# EAGLE design reversed (EAGLE 9.6.2)
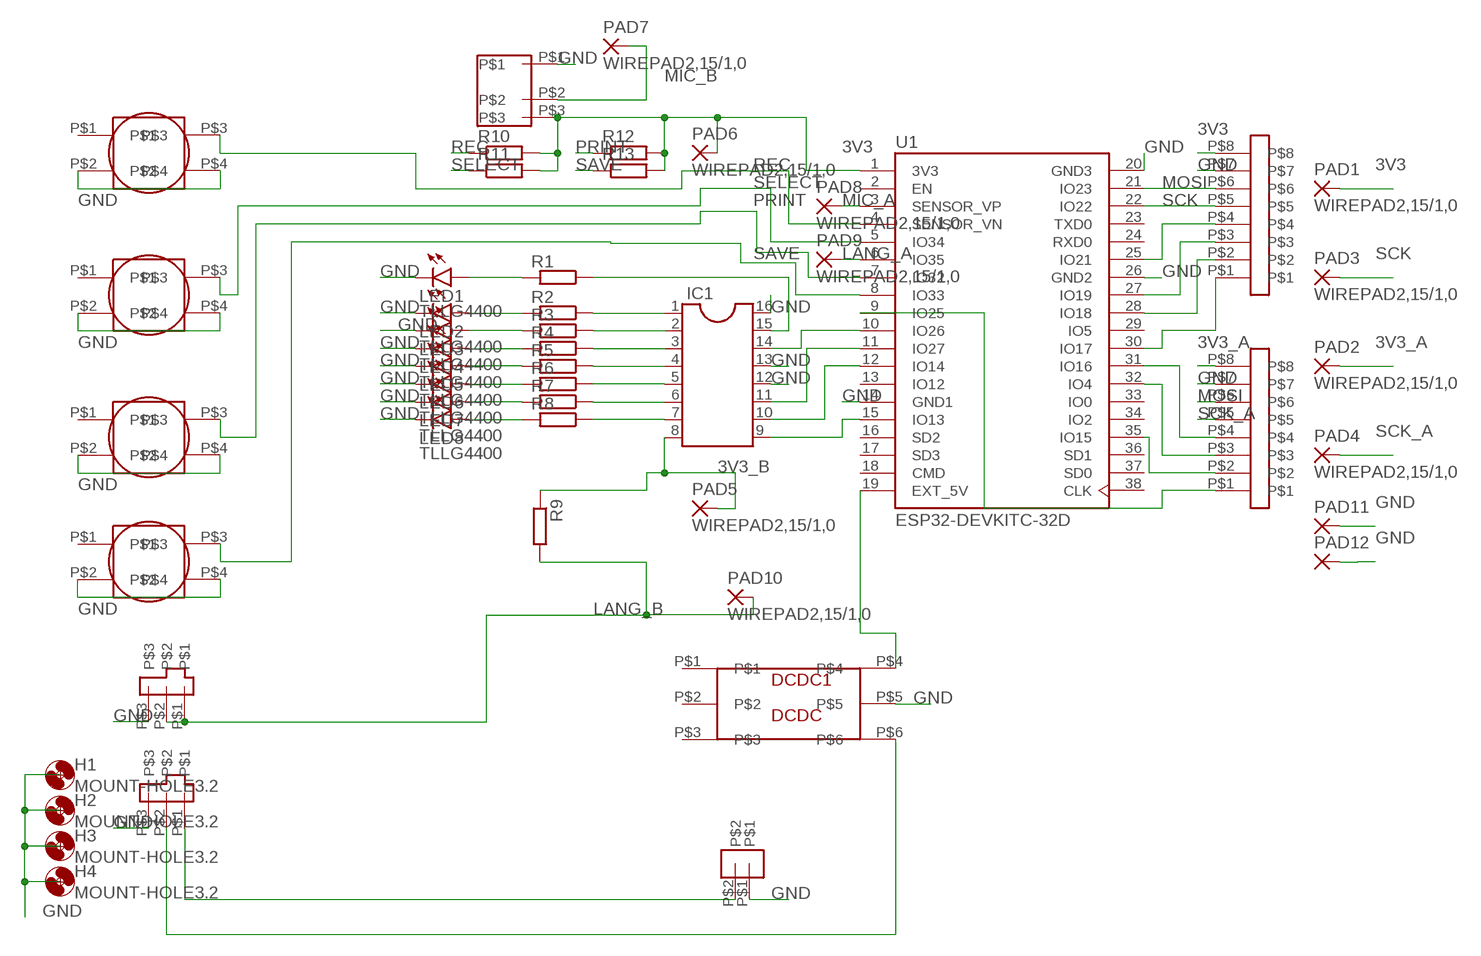
[diagram p0: schematic, sheet 1]

## Parts
BATTERY1  BATTERY  [BATTERY]
DCDC1  DCDC  [DCDC]
DISPLAY1  DISPLAY  [DISPLAY]
DISPLAY2  DISPLAY  [DISPLAY]
H1  MOUNT-HOLE3.2  [3,2]
H2  MOUNT-HOLE3.2  [3,2]
H3  MOUNT-HOLE3.2  [3,2]
H4  MOUNT-HOLE3.2  [3,2]
IC1  DIL16S  [SOCKET-16]
LED1  TLLG4400  [LED3MM]
LED2  TLLG4400  [LED3MM]
LED3  TLLG4400  [LED3MM]
LED4  TLLG4400  [LED3MM]
LED5  TLLG4400  [LED3MM]
LED6  TLLG4400  [LED3MM]
LED7  TLLG4400  [LED3MM]
LED8  TLLG4400  [LED3MM]
MIC1  MIC  [MIC]
PAD1  WIREPAD2,15/1,0  [2,15/1,0]
PAD2  WIREPAD2,15/1,0  [2,15/1,0]
PAD3  WIREPAD2,15/1,0  [2,15/1,0]
PAD4  WIREPAD2,15/1,0  [2,15/1,0]
PAD5  WIREPAD2,15/1,0  [2,15/1,0]
PAD6  WIREPAD2,15/1,0  [2,15/1,0]
PAD7  WIREPAD2,15/1,0  [2,15/1,0]
PAD8  WIREPAD2,15/1,0  [2,15/1,0]
PAD9  WIREPAD2,15/1,0  [2,15/1,0]
PAD10  WIREPAD2,15/1,0  [2,15/1,0]
PAD11  2,15/1,0  [2,15/1,0]
PAD12  2,15/1,0  [2,15/1,0]
R1  SMK  [SMK]
R2  SMK  [SMK]
R3  SMK  [SMK]
R4  SMK  [SMK]
R5  SMK  [SMK]
R6  SMK  [SMK]
R7  SMK  [SMK]
R8  SMK  [SMK]
R9  R-EU_0207/10  [0207/10]
R10  R-EU_0207/10  [0207/10]
R11  R-EU_0207/10  [0207/10]
R12  R-EU_0207/10  [0207/10]
R13  R-EU_0207/10  [0207/10]
SWITCH1  SWITCH  [SWITCH]
SWITCH2  SWITCH  [SWITCH]
SWITCH3  SWITCH  [SWITCH]
SWITCH4  SWITCH  [SWITCH]
TOGGLE1  TOGGLE  [TOGGLE]
TOGGLE2  TOGGLE  [TOGGLE]
U1  ESP32-DEVKITC-32D  [MODULE_ESP32-DEVKITC-32D]

## Nets
3V3: DISPLAY1.P$8 MIC1.P$3 PAD1.1(P) PAD6.1(P) R10.2 R11.2 R12.2 R13.2 U1.1(3V3)
3V3_A: DISPLAY2.P$8 PAD2.1(P)
3V3_B: IC1.8 PAD5.1(P) R9.1
GND: BATTERY1.P$1 DCDC1.P$5 DISPLAY1.P$7 DISPLAY2.P$7 IC1.12 IC1.13 IC1.16 LED1.K(C) LED2.K(C) LED3.K(C) LED4.K(C) LED5.K(C) LED6.K(C) LED7.K(C) LED8.K(C) MIC1.P$1 PAD11.1(P) PAD12.1(P) SWITCH1.P$2 SWITCH1.P$4 SWITCH2.P$2 SWITCH2.P$4 SWITCH3.P$2 SWITCH3.P$4 SWITCH4.P$2 SWITCH4.P$4 TOGGLE1.P$3 TOGGLE2.P$3 U1.14(GND1) U1.20(GND3) U1.26(GND2)
LANG_A: PAD9.1(P) U1.6(IO35)
LANG_B: PAD10.1(P) R9.2 TOGGLE1.P$1 TOGGLE1.P$2
MIC_A: PAD8.1(P) U1.3(SENSOR_VP)
MIC_B: MIC1.P$2 PAD7.1(P)
MOSI: DISPLAY1.P$6 DISPLAY2.P$6 U1.21(IO23)
N$1: DISPLAY1.P$4 U1.25(IO21)
N$2: DISPLAY1.P$3 U1.27(IO19)
N$3: DISPLAY1.P$2 U1.28(IO18)
N$4: DISPLAY1.P$1 U1.30(IO17)
N$5: DISPLAY2.P$4 U1.31(IO16)
N$6: DISPLAY2.P$3 U1.32(IO4)
N$7: DISPLAY2.P$2 U1.35(IO15)
N$8: DISPLAY2.P$1 U1.9(IO25)
N$9: IC1.9 U1.15(IO13)
N$10: IC1.10 U1.12(IO14)
N$11: IC1.11 U1.11(IO27)
N$12: IC1.14 U1.10(IO26)
N$13: IC1.15 R1.1
N$14: IC1.1 R2.1
N$15: IC1.2 R3.1
N$16: IC1.3 R4.1
N$17: IC1.4 R5.1
N$18: IC1.5 R6.1
N$19: IC1.6 R7.1
N$20: IC1.7 R8.1
N$21: DCDC1.P$4 U1.19(EXT_5V)
N$22: LED1.A R1.2
N$23: LED2.A R2.2
N$24: LED3.A R3.2
N$25: LED4.A R4.2
N$26: LED5.A R5.2
N$27: LED6.A R6.2
N$28: LED7.A R7.2
N$29: LED8.A R8.2
N$30: DCDC1.P$6 TOGGLE2.P$2
N$31: BATTERY1.P$2 TOGGLE2.P$1
PRINT: R12.1 SWITCH3.P$3 U1.7(IO32)
REC: R10.1 SWITCH1.P$3 U1.4(SENSOR_VN)
SAVE: R13.1 SWITCH4.P$3 U1.8(IO33)
SCK: DISPLAY1.P$5 PAD3.1(P) U1.22(IO22)
SCK_A: DISPLAY2.P$5 PAD4.1(P)
SELECT: R11.1 SWITCH2.P$3 U1.5(IO34)
Unconnected: DCDC1.P$1 DCDC1.P$2 DCDC1.P$3 SWITCH1.P$1 SWITCH2.P$1 SWITCH3.P$1 SWITCH4.P$1 U1.2(EN) U1.13(IO12) U1.16(SD2) U1.17(SD3) U1.18(CMD) U1.23(TXD0) U1.24(RXD0) U1.29(IO5) U1.33(IO0) U1.34(IO2) U1.36(SD1) U1.37(SD0) U1.38(CLK)

## Library data of the parts
BATTERY1 = BATTERY:BATTERY
DCDC1 = DCDC:DCDC
DISPLAY1 DISPLAY2 = DISPLAY:DISPLAY
H1-H4 = holes:MOUNT-HOLE: MOUNTING HOLE with drill center marker
IC1 = ic-package:DIL16: Dual In Line / Socket
LED1-LED8 = led:TLLG4400: Low Current (2mA) LED 3 mm Tinted Diffused Package color GREEN Source: Data sheet <http://www.farnell.com/datasheets/391098.pdf>; MF: VISHAY SEMICONDUCTOR; OC_FARNELL: 1612435
MIC1 = MIC:MIC
PAD1-PAD10 = wirepad:WIREPAD: Wire PAD connect wire on PCB
PAD11 PAD12 = wirepad:2,15/1,0: THROUGH-HOLE PAD
R1-R8 = resistor-shunt:SMK: SMD SHUNT RESISTOR; OC_FARNELL: unknown; OC_NEWARK: unknown
R9-R13 = rcl:R-EU_: RESISTOR, European symbol; SPICEPREFIX: R
SWITCH1-SWITCH4 = SWITCH:SWITCH
TOGGLE1 TOGGLE2 = TOGGLE:TOGGLE
U1 = ESP32-DEVKITC-32D:ESP32-DEVKITC-32D: Eval Board For Esp-Wroom-32 Check availability <https://pricing.snapeda.com/parts/ESP32-DEVKITC-32D/Espressif%20Systems/view-part?ref=eda>; AVAILABILITY: In Stock; DESCRIPTION: WiFi Development Tools (802.11) ESP32 General Development Kit, ESP32-WROOM-32D on the board; MF: Espressif Systems; MP: ESP32-DEVKITC-32D; PACKAGE: None; PRICE: None; PURCHASE-URL: https://pricing.snapeda.com/search/part/ESP32-DEVKITC-32D/?ref=eda

## Board
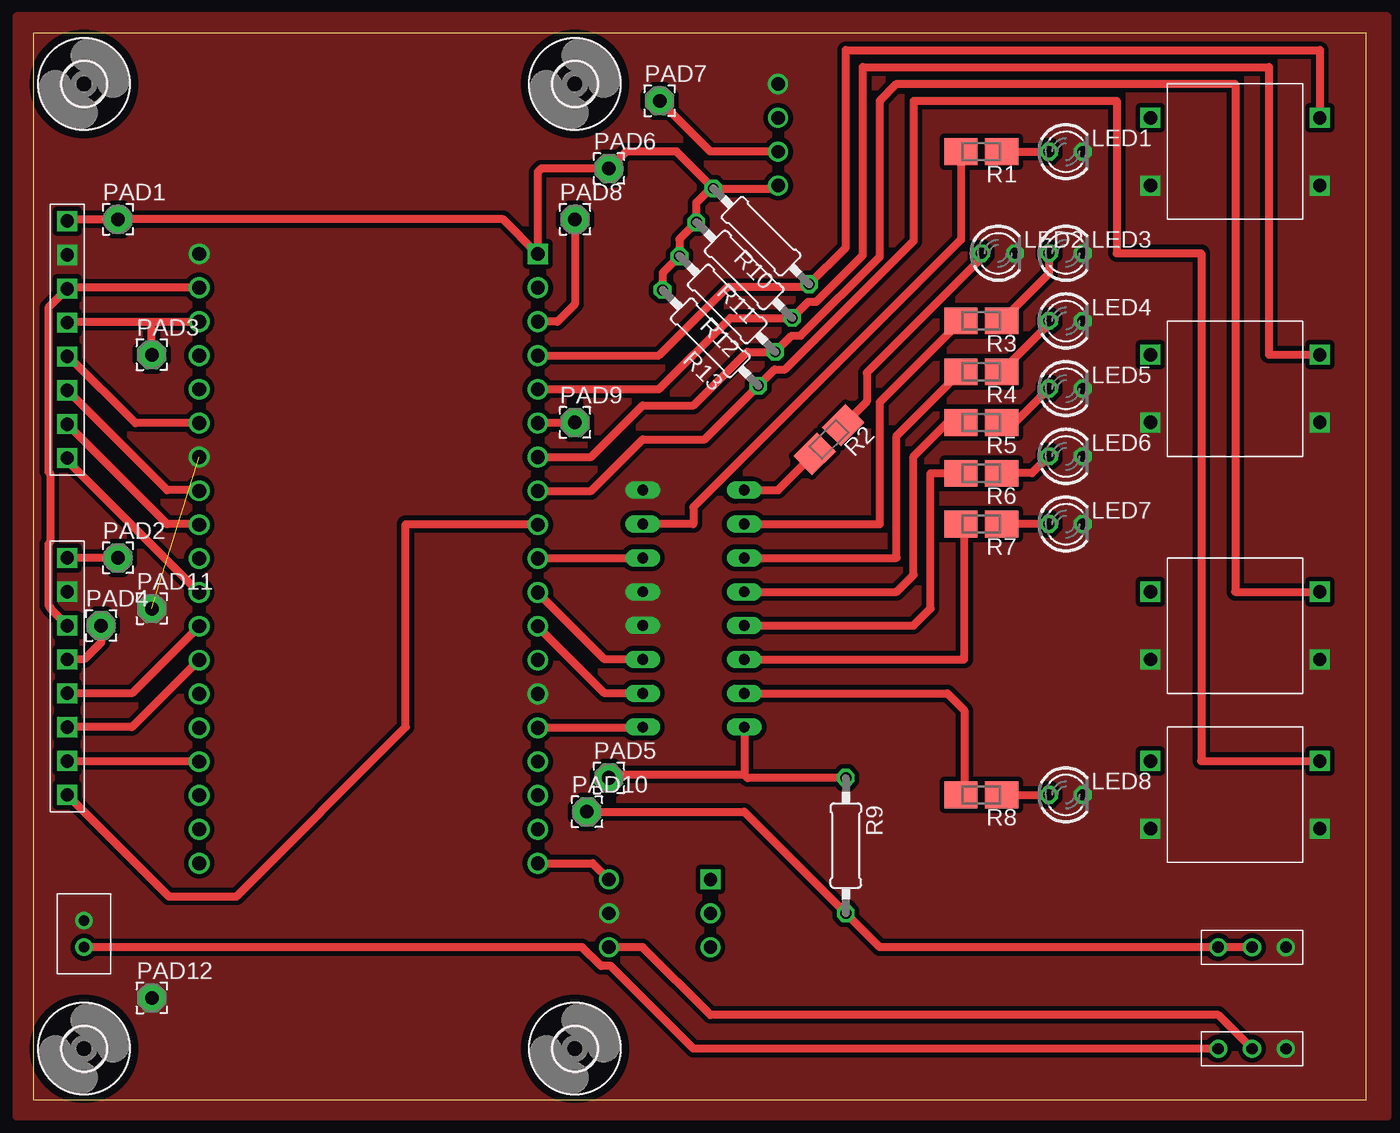
[diagram p1: board, top side]
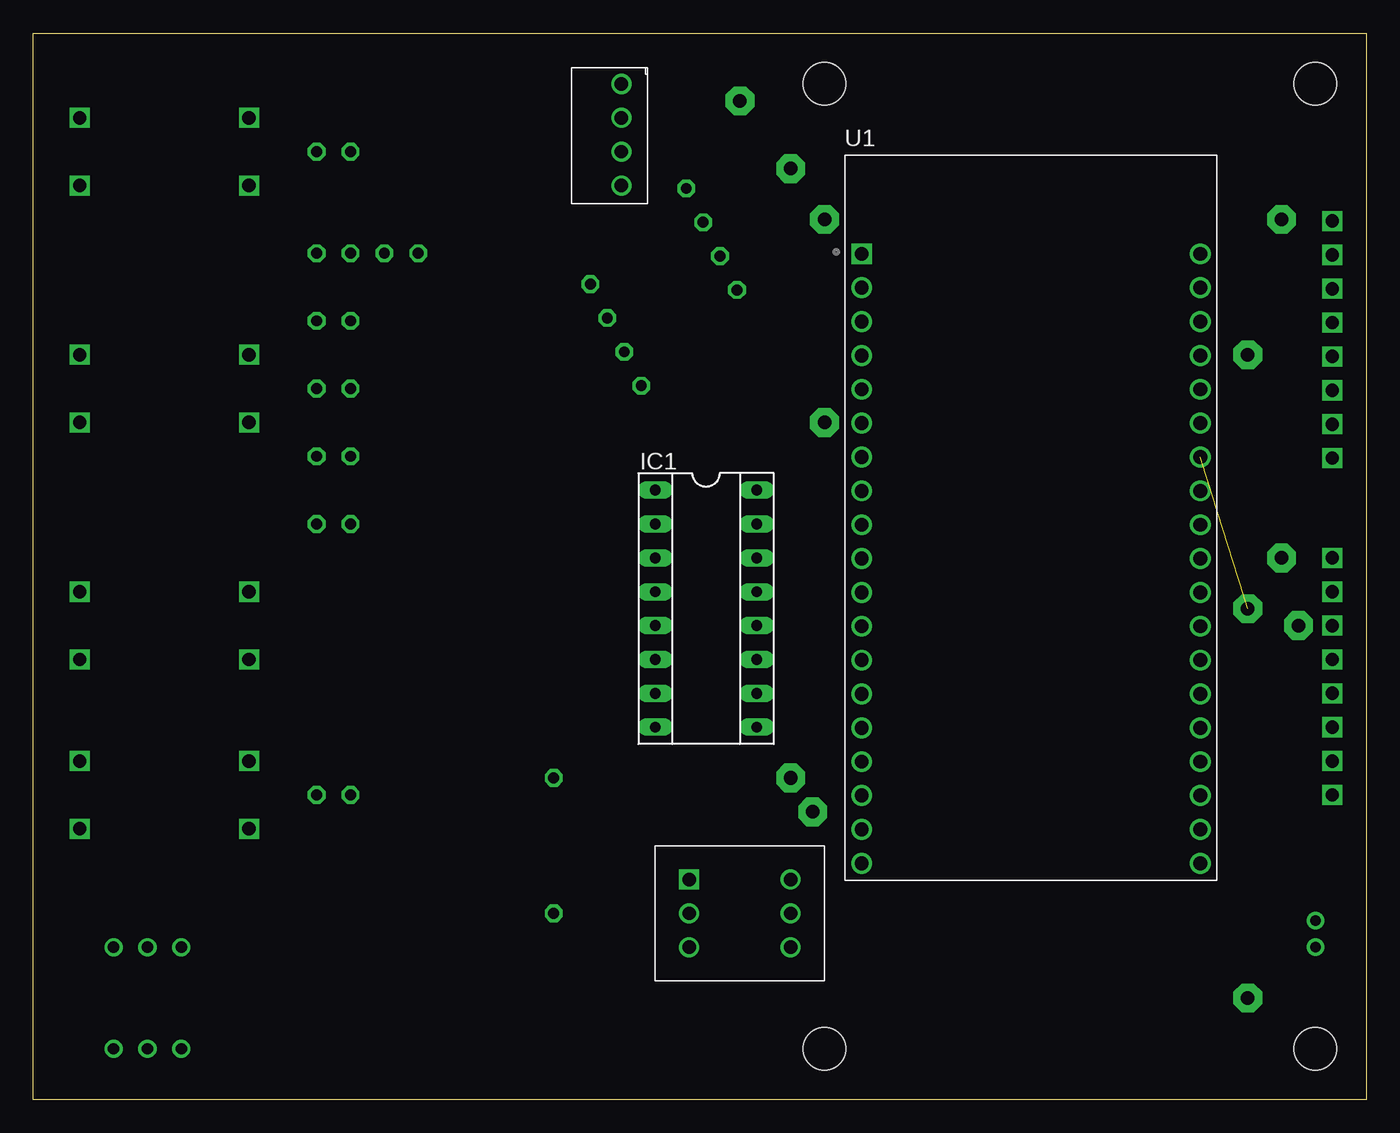
[diagram p2: board, bottom side, seen from below]

Size 100 x 80 mm. Coordinates in mm from the lower left corner, seen from the top.
Outline: 0,0 100,0 100,80 0,80 0,0
Copper layers (1*16): Top 0.035mm / dielectric 1.5mm / Bottom 0.035mm
Design rules "default *": minimum track width 6mil, minimum drill 0.6mm, track to track 14mil, track to pad 14mil, pad to pad 14mil, via to via 14mil, smd to smd 6mil, copper to edge 0mil, drill to drill 6mil, minimum pad ring 10mil, minimum via ring 8mil, stop-mask expansion 4mil, vias tented up to drill 0mil, thermal gap 10mil

### Footprints (pad centres in the part's own frame; a part is rotated, then mirrored left to right if it is on the bottom)
BATTERY = drill 0.8: P$1 0,2; P$2 0,0
DCDC = drill 1 square: P$1 -5.08,2.54 | drill 1: P$2 -5.08,0; P$3 -5.08,-2.54; P$4 2.54,2.54; P$5 2.54,0; P$6 2.54,-2.54
DISPLAY = drill 1 square: P$1 0,7.62; P$2 0,5.08; P$3 0,2.54; P$4 0,0; P$5 0,-2.54; P$6 0,-5.08; P$7 0,-7.62; P$8 0,-10.16
3,2 = hole 3.2: 0,0
SOCKET-16 = drill 0.813 long: 1 -8.89,-3.81; 2 -6.35,-3.81; 3 -3.81,-3.81; 4 -1.27,-3.81; 5 1.27,-3.81; 6 3.81,-3.81; 7 6.35,-3.81; 8 8.89,-3.81; 9 8.89,3.81; 10 6.35,3.81; 11 3.81,3.81; 12 1.27,3.81; 13 -1.27,3.81; 14 -3.81,3.81; 15 -6.35,3.81; 16 -8.89,3.81
LED3MM = drill 0.813 octagon: A -1.27,0; K 1.27,0
MIC = drill 1: P$1 2.54,5.08; P$2 2.54,0; P$3 2.54,-2.54; P$4 2.54,2.54
2,15/1,0 = drill 1.016 pad 2.159 octagon: 1 0,0
SMK = smd 2.5 x 2: 1 1.524,0; 2 -1.524,0
0207/10 = drill 0.813 octagon: 1 -5.08,0; 2 5.08,0
SWITCH = drill 1 square: P$1 -6.35,2.54; P$2 -6.35,-2.54; P$3 6.35,2.54; P$4 6.35,-2.54
TOGGLE = drill 0.85: P$1 0,2.54; P$2 0,0; P$3 0,-2.54
MODULE_ESP32-DEVKITC-32D = drill 1.04 square: 1 -12.7,19.76 | drill 1.04: 2 -12.7,17.22; 3 -12.7,14.68; 4 -12.7,12.14; 5 -12.7,9.6; 6 -12.7,7.06; 7 -12.7,4.52; 8 -12.7,1.98; 9 -12.7,-0.56; 10 -12.7,-3.1; 11 -12.7,-5.64; 12 -12.7,-8.18; 13 -12.7,-10.72; 14 -12.7,-13.26; 15 -12.7,-15.8; 16 -12.7,-18.34; 17 -12.7,-20.88; 18 -12.7,-23.42; 19 -12.7,-25.96; 20 12.7,19.76; 21 12.7,17.22; 22 12.7,14.68; 23 12.7,12.14; 24 12.7,9.6; 25 12.7,7.06; 26 12.7,4.52; 27 12.7,1.98; 28 12.7,-0.56; 29 12.7,-3.1; 30 12.7,-5.64; 31 12.7,-8.18; 32 12.7,-10.72; 33 12.7,-13.26; 34 12.7,-15.8; 35 12.7,-18.34; 36 12.7,-20.88; 37 12.7,-23.42; 38 12.7,-25.96

### Placement (x,y rotation side)
BATTERY1  3.81,11.43 0 top
DCDC1  45.72,13.97 0 bottom
DISPLAY1  2.54,55.75 180 top
DISPLAY2  2.54,30.48 180 top
H1  3.81,3.81 0 top
H2  40.64,3.81 0 top
H3  40.64,76.2 0 top
H4  3.81,76.2 0 top
IC1  49.53,36.83 270 bottom
LED1  77.47,71.12 0 top
LED2  72.39,63.5 0 top
LED3  77.47,63.5 0 top
LED4  77.47,58.42 0 top
LED5  77.47,53.34 0 top
LED6  77.47,48.26 0 top
LED7  77.47,43.18 0 top
LED8  77.47,22.86 0 top
MIC1  58.42,71.12 0 bottom
PAD1  6.35,66.04 0 top
PAD2  6.35,40.64 0 top
PAD3  8.89,55.88 0 top
PAD4  5.08,35.56 0 top
PAD5  43.18,24.13 0 top
PAD6  43.18,69.85 0 top
PAD7  46.99,74.93 0 top
PAD8  40.64,66.04 0 top
PAD9  40.64,50.8 0 top
PAD10  41.53,21.59 0 top
PAD11  8.89,36.83 0 top
PAD12  8.89,7.62 0 top
R1  71.12,71.12 180 top
R2  59.69,49.53 225 top
R3  71.12,58.42 180 top
R4  71.12,54.61 180 top
R5  71.12,50.8 180 top
R6  71.12,46.99 180 top
R7  71.12,43.18 180 top
R8  71.12,22.86 180 top
R9  60.96,19.05 270 top
R10  54.61,64.77 135 top
R11  53.34,62.23 135 top
R12  52.07,59.69 135 top
R13  50.8,57.15 135 top
SWITCH1  90.17,71.12 0 top
SWITCH2  90.17,53.34 0 top
SWITCH3  90.17,35.56 0 top
SWITCH4  90.17,22.86 0 top
TOGGLE1  91.44,11.43 90 top
TOGGLE2  91.44,3.81 90 top
U1  25.15,43.69 0 bottom

### Tracks (layer width: path | path; a pad name or v marks a point on that pad's centre or on a via)
3V3
  Top 0.61: DISPLAY1.P$8 2.67,66.04 PAD1.1 35.25,66.04 U1.1 37.85,69.6 38.1,69.85 PAD6.1 44.45,71.12 48.26,71.12 R10.2 | R10.2 51.02,68.58 49.75,67.31 R11.2 48.48,64.55 R12.2 47.21,62.01 R13.2 | R10.2 55.66,68.36 MIC1.P$3
3V3_A
  Top 0.61: PAD2.1 DISPLAY2.P$8
3V3_B
  Top 0.61: PAD5.1 43.43,24.38 53.34,24.38 | IC1.8 53.34,24.38 | R9.1 53.59,24.13 53.34,24.38
GND  (1 unrouted)
  pour Top (no thermals): 101.6,81.28 -1.27,81.28 -1.27,-1.27 101.6,-1.27
LANG_A
  Top 0.61: U1.6 37.9,50.8 PAD9.1
LANG_B
  Top 0.61: TOGGLE1.P$2 TOGGLE1.P$1 63.5,11.43 R9.2 53.34,21.59 PAD10.1 41.78,21.34
MIC_A
  Top 0.61: PAD8.1 40.64,59.69 39.32,58.37 U1.3
MIC_B
  Top 0.61: MIC1.P$2 50.8,71.12 PAD7.1
MOSI
  Top 0.61: U1.21 2.62,60.91 DISPLAY1.P$6 1.13,59.42 1.13,47.1 1.26,46.98 1.26,41.8 1.13,41.67 1.13,37.07 1.27,36.93 1.27,36.83 DISPLAY2.P$6
N$1
  Top 0.61: U1.25 7.67,50.75 2.67,55.75 DISPLAY1.P$4
N$2
  Top 0.61: U1.27 12.39,45.72 10.03,45.72 DISPLAY1.P$3
N$3
  Top 0.61: U1.28 12.39,43.18 10.03,43.18 DISPLAY1.P$2
N$4
  Top 0.61: U1.30 2.54,47.95 DISPLAY1.P$1
N$5
  Top 0.61: U1.31 7.42,30.48 DISPLAY2.P$4
N$6
  Top 0.61: U1.32 7.42,27.94 DISPLAY2.P$3
N$7
  Top 0.61: DISPLAY2.P$2 12.39,25.4 U1.35
N$8
  Top 0.61: DISPLAY2.P$1 10.16,15.24 15.24,15.24 27.94,27.94 27.94,43.18 37.79,43.18 U1.9
N$9
  Top 0.61: IC1.9 45.67,27.89 U1.15
N$10
  Top 0.61: U1.12 42.87,30.48 IC1.10
N$11
  Top 0.61: U1.11 42.87,33.02 IC1.11
N$12
  Top 0.61: IC1.14 45.67,40.59 U1.10
N$13
  Top 0.61: IC1.15 49.53,43.18 49.53,44.45 69.6,64.52 R1.1
N$14
  Top 0.61: IC1.1 55.88,45.72 R2.1
N$15
  Top 0.61: IC1.2 63.5,43.18 63.5,52.32 R3.1
N$16
  Top 0.61: IC1.3 64.77,40.64 64.77,49.78 R4.1
N$17
  Top 0.61: IC1.4 64.77,38.1 66.04,39.37 66.04,48.26 68.58,50.8 R5.1
N$18
  Top 0.61: IC1.5 66.04,35.56 67.31,36.83 67.31,46.99 R6.1
N$19
  Top 0.61: IC1.6 69.85,33.02 69.85,42.93 R7.1
N$20
  Top 0.61: IC1.7 68.58,30.48 69.85,29.21 69.85,23.11 R8.1
N$21
  Top 0.61: U1.19 41.96,17.73 DCDC1.P$4
N$22
  Top 0.61: R1.2 LED1.A
N$23
  Top 0.61: LED2.A 71.12,63.13 62.53,54.54 62.53,52.38 R2.2
N$24
  Top 0.61: LED3.A 76.2,61.98 R3.2
N$25
  Top 0.61: LED4.A 76.2,58.17 R4.2
N$26
  Top 0.61: LED5.A 73.66,50.8 R5.2
N$27
  Top 0.61: LED6.A 74.93,46.99 R6.2
N$28
  Top 0.61: LED7.A R7.2
N$29
  Top 0.61: R8.2 LED8.A
N$30
  Top 0.61: TOGGLE2.P$2 88.9,6.35 50.8,6.35 45.72,11.43 DCDC1.P$6
N$31
  Top 0.61: TOGGLE2.P$1 49.53,3.81 43.32,10.02 42.59,10.02 41.18,11.43 BATTERY1.P$2
PRINT
  Top 0.61: U1.7 41.86,48.21 45.72,52.07 49.53,52.07 53.56,56.1 R12.1 56.88,57.32 57.57,57.32 63.5,63.24 63.5,74.93 64.77,76.2 90.17,76.2 90.17,38.1 SWITCH3.P$3
REC
  Top 0.61: U1.4 46.94,55.83 52.07,60.96 57.98,60.96 R10.1 60.96,63.94 60.96,78.74 96.52,78.74 SWITCH1.P$3
SAVE
  Top 0.61: U1.8 41.86,45.67 45.72,49.53 50.36,49.53 R13.1 55.61,54.78 56.4,54.78 66.04,64.42 66.04,74.93 81.28,74.93 81.28,63.5 87.63,63.5 87.63,25.4 SWITCH4.P$3
SCK
  Top 0.61: DISPLAY1.P$5 2.62,58.37 8.89,58.37 | 8.89,58.37 U1.22 | PAD3.1 8.89,58.37
SCK_A
  Top 0.61: PAD4.1 5.08,34.29 3.81,33.02 DISPLAY2.P$5
SELECT
  Top 0.61: U1.5 46.94,53.29 52.29,58.64 R11.1 58.15,59.86 58.75,59.86 62.23,63.34 62.23,77.47 92.71,77.47 92.71,55.88 SWITCH2.P$3